# EAGLE design boomerang (EAGLE 6.4)
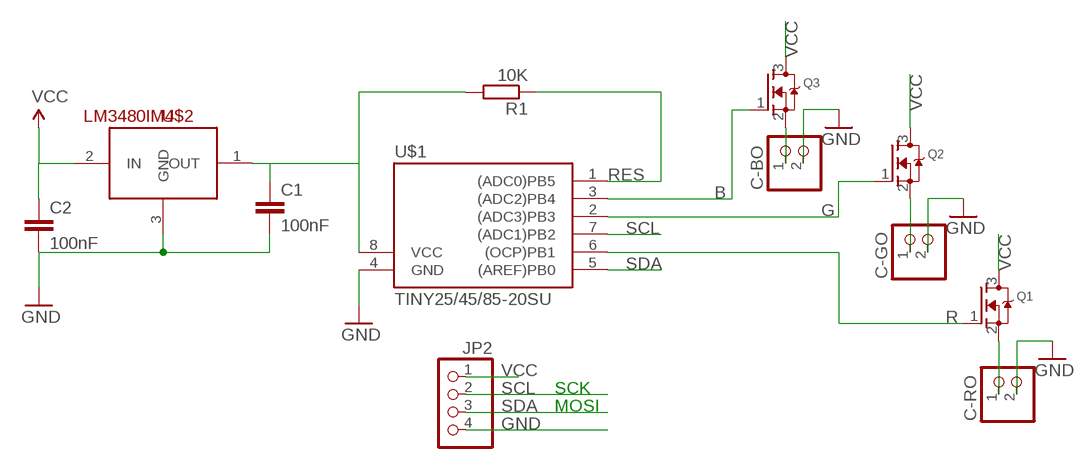
[diagram p0: schematic, sheet 1]

## Parts
C1  100nF  C-EUC0603  [C0603]
C2  100nF  C-EUC0603  [C0603]
C-BO  PINHD-1X2M  [1X02M]
C-GO  PINHD-1X2M  [1X02M]
C-RO  PINHD-1X2M  [1X02M]
JP2  PINHD-1X4_2.54-SMD-90°  [1X04SMD/90]
Q1  MOSFET-NREFLOW  [SOT23]
Q2  MOSFET-NREFLOW  [SOT23]
Q3  MOSFET-NREFLOW  [SOT23]
R1  10K  R-EU_R0603  [R0603]
U$1  TINY25/45/85-20SU  [SOIC8]
U$2  LM3480IM4  [SOT23-3]

## Nets
B: Q3.1(G) U$1.3((ADC2)PB4)
BO: C-BO.1 Q3.2(S)
G: Q2.1(G) U$1.2((ADC3)PB3)
GND: C1.2 C2.2 C-BO.2 C-GO.2 C-RO.2 JP2.4 U$1.4(GND) U$2.3(GND)
GO: C-GO.1 Q2.2(S)
R: Q1.1(G) U$1.6((OCP)PB1)
RES: R1.1 U$1.1((ADC0)PB5)
RO: C-RO.1 Q1.2(S)
SCL: JP2.2 U$1.7((ADC1)PB2)
SDA: JP2.3 U$1.5((AREF)PB0)
VCC: C2.1 JP2.1 Q1.3(D) Q2.3(D) Q3.3(D) U$2.2(IN)
VCC_GOOD: C1.1 R1.2 U$1.8(VCC) U$2.1(OUT)

## Notes on the sheet
- SCK
- MOSI

## Library data of the parts
C1 C2 = resistor:C-EU: CAPACITOR, European symbol
C-BO C-GO C-RO = pinhead:PINHD-1X2: PIN HEADER
JP2 = pinhead-1:PINHD-1X4: PIN HEADER
Q1-Q3 = adafruit:MOSFET-N: N-Channel Mosfet 2N7002E - 60V 260mA SOT23 [Digikey: 2N7002ET1GOSTR-ND] - REEL BSH103 - 30V 850mA SOT23 [Digikey: 568-5013-1-ND]
R1 = resistor:R-EU_: RESISTOR, European symbol
U$1 = avr-7:TINY25/45/85
U$2 = SparkFun-PowerIC:LM3480IM4: Small package linear regulator

## Board
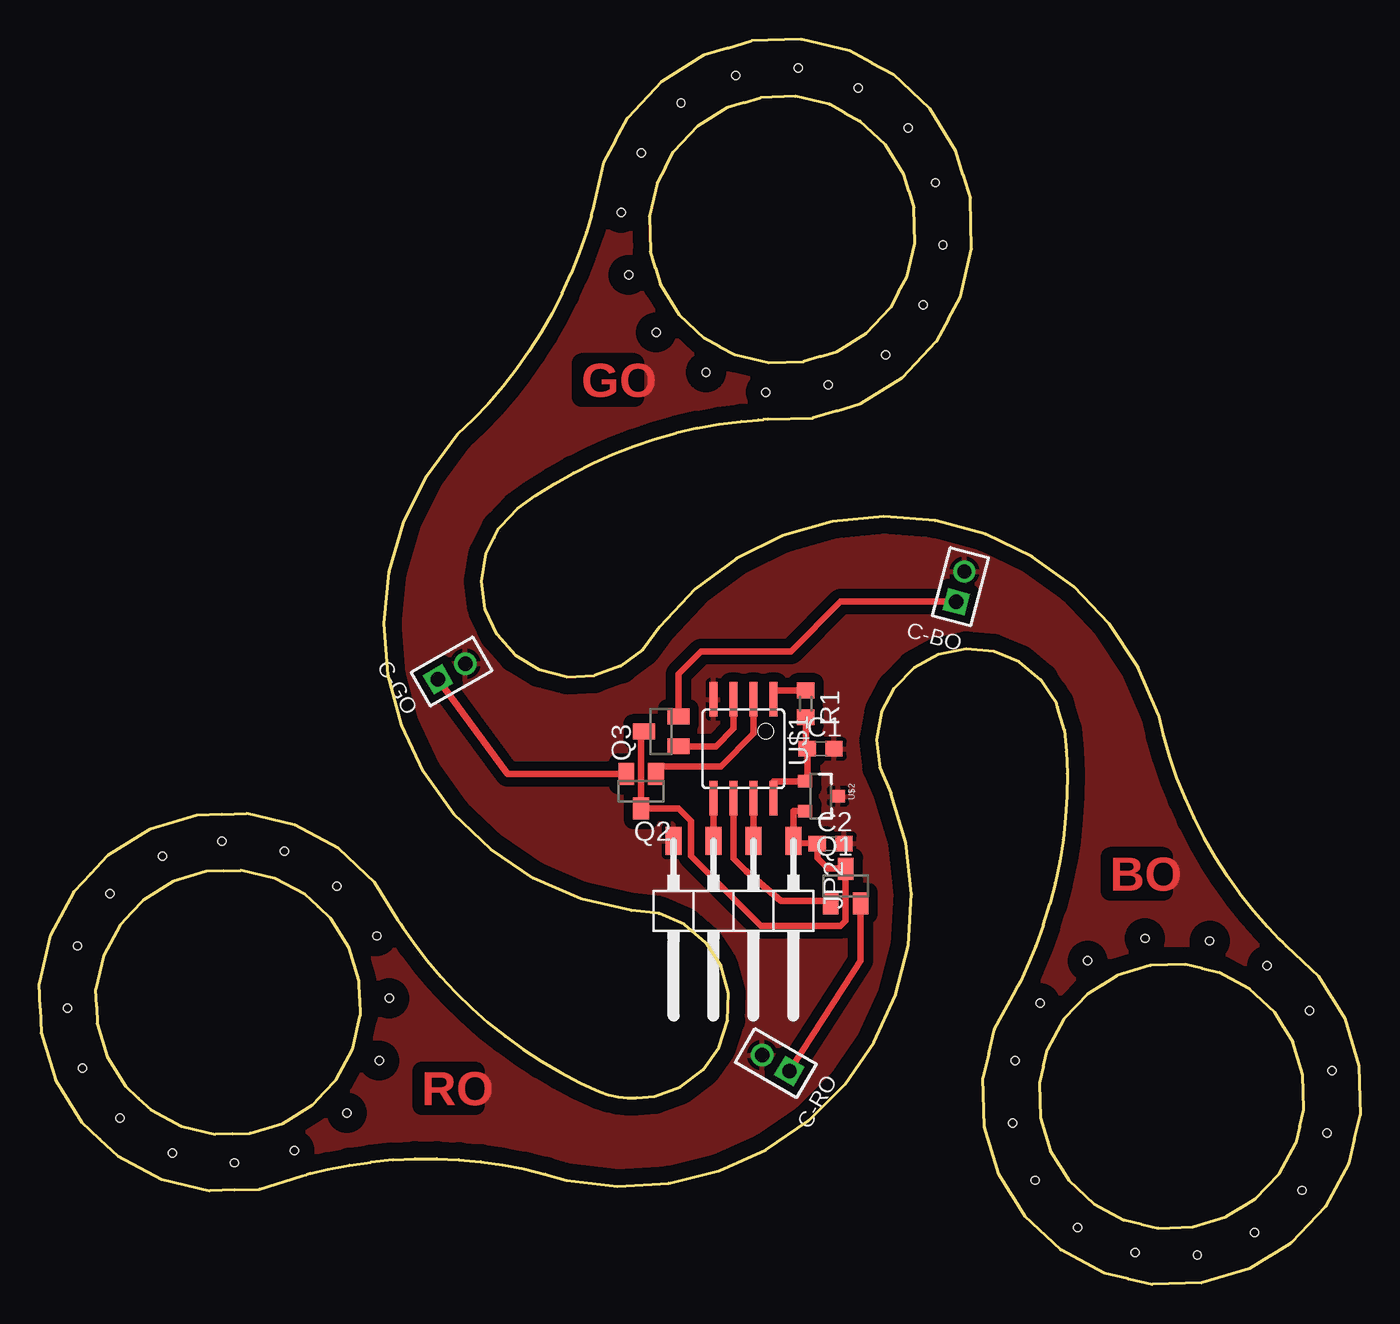
[diagram p1: board, top side]

Size 84.08 x 79.26 mm. Coordinates in mm from the lower left corner, seen from the top.
Outline: 78.93,21.97 79.15,21.76 79.36,21.54 81.44,19.61 82.27,18.27 83.09,16.93 83.99,13.92 84.08,10.78 83.71,9.25 83.35,7.72 81.85,4.95 79.68,2.66 78.34,1.83 77,1.01 73.99,0.1 70.84,0 69.31,0.36 67.78,0.72 65.01,2.2 62.72,4.35 61.89,5.68 61.07,7.02 60.16,10.03 60.07,13.17 60.43,14.7 60.79,16.23 62.16,18.73 62.29,19.01 62.43,19.27 62.89,20.27 63.43,21.56 63.91,22.87 64.32,24.21 64.67,25.57 64.96,26.94 65.17,28.32 65.32,29.71 65.41,31.11 65.42,32.51 65.37,33.91 65.25,35.31 64.82,36.77 64.74,37.01 64.39,37.53 63.76,38.49 62.39,39.62 60.75,40.29 58.98,40.46 57.24,40.1 55.68,39.25 54.44,37.98 53.62,36.4 53.3,34.65 53.5,32.89 54.21,31.26 55.16,28.12 55.53,24.86 55.31,21.59 54.5,18.41 53.14,15.43 51.27,12.74 48.94,10.43 46.24,8.57 43.25,7.23 40.07,6.44 36.8,6.24 33.55,6.62 32.21,7.02 30.85,7.35 29.48,7.61 28.09,7.81 26.7,7.94 25.3,8 23.91,8 22.51,7.93 21.12,7.79 19.74,7.59 18.37,7.32 17.3,7.07 17.01,6.98 16.72,6.91 14,6.07 12.43,6.02 10.85,5.97 7.79,6.69 5.01,8.17 3.85,9.25 2.7,10.33 1.03,13 0.11,16.01 0.06,17.58 0,19.16 0.71,22.22 2.19,25 3.26,26.15 4.34,27.3 7.02,28.96 10.03,29.87 11.61,29.92 13.19,29.97 16.26,29.25 19.05,27.76 20.2,26.68 21.35,25.6 22.84,23.17 23.02,22.92 23.18,22.66 23.81,21.77 24.66,20.66 25.57,19.59 26.52,18.57 27.52,17.59 28.57,16.66 29.66,15.79 30.8,14.97 31.97,14.2 33.17,13.49 34.41,12.84 35.68,12.26 36.25,12.06 36.83,11.94 37.16,11.91 37.43,11.88 38.03,11.89 39.17,11.96 40.83,12.58 42.23,13.67 43.26,15.11 43.82,16.79 43.86,18.56 43.38,20.26 42.43,21.76 41.07,22.9 39.45,23.61 37.68,23.8 34.49,24.55 31.47,25.85 28.74,27.68 26.38,29.96 24.47,32.64 23.07,35.61 22.21,38.78 21.95,42.06 22.27,45.34 23.18,48.5 24.64,51.45 26.6,54.09 27.62,55.06 28.59,56.08 29.51,57.15 30.37,58.25 31.18,59.4 31.94,60.59 32.64,61.81 33.28,63.06 33.85,64.35 34.37,65.66 34.82,66.99 35.14,68.05 35.21,68.35 35.29,68.64 35.93,71.44 36.68,72.84 37.43,74.24 39.59,76.56 42.29,78.24 43.81,78.7 45.32,79.16 48.49,79.26 51.58,78.53 52.97,77.78 54.37,77.03 56.68,74.85 58.34,72.15 58.8,70.63 59.25,69.1 59.35,65.93 58.62,62.84 57.87,61.44 57.12,60.04 54.95,57.73 52.26,56.06 50.74,55.6 49.23,55.14 46.37,55.07 46.07,55.04 45.76,55.03 44.67,54.93 43.28,54.75 41.89,54.5 40.53,54.19 39.17,53.81 37.84,53.36 36.53,52.85 35.25,52.28 34,51.65 32.78,50.96 31.59,50.21 30.44,49.4 29.4,48.29 29.22,48.11 28.95,47.54 28.44,46.51 28.15,44.75 28.39,42.99 29.13,41.37 30.31,40.04 31.83,39.12 33.55,38.68 35.33,38.76 37,39.36 38.43,40.42 39.48,41.85 41.73,44.25 44.37,46.21 47.32,47.67 50.49,48.57 53.76,48.89 57.04,48.61 60.21,47.76 63.18,46.34 65.85,44.42 68.12,42.05 69.93,39.31 71.22,36.29 71.54,34.92 71.93,33.58 72.39,32.25 72.91,30.95 73.49,29.68 74.13,28.44 74.83,27.23 75.58,26.05 76.4,24.92 77.26,23.82 78.18,22.77 78.93,21.97
Outline: 46.43,58.67 48.64,58.74 49.7,59.06 50.76,59.38 52.65,60.55 54.17,62.17 54.69,63.15 55.22,64.13 55.73,66.29 55.66,68.51 55.34,69.58 55.02,70.64 53.85,72.54 52.24,74.06 51.26,74.59 50.29,75.11 48.13,75.62 45.91,75.55 44.85,75.23 43.79,74.91 41.9,73.73 40.38,72.11 39.86,71.13 39.34,70.15 38.83,67.98 38.9,65.76 39.22,64.7 39.54,63.63 40.71,61.75 42.32,60.23 43.3,59.7 44.27,59.18 46.43,58.67
Outline: 65.23,16.89 64.18,14.95 63.93,13.88 63.67,12.81 63.74,10.61 64.37,8.5 64.95,7.57 65.53,6.63 67.13,5.13 69.07,4.09 70.14,3.84 71.21,3.59 73.42,3.66 75.53,4.29 76.46,4.87 77.4,5.45 78.92,7.05 79.97,8.99 80.22,10.06 80.48,11.13 80.42,13.33 79.79,15.44 79.21,16.38 78.63,17.31 77.03,18.82 75.09,19.86 74.01,20.12 72.94,20.37 70.73,20.3 68.62,19.66 67.68,19.08 66.74,18.5 65.23,16.89
Outline: 19.72,21.43 18.55,23.31 17.74,24.06 16.94,24.82 14.99,25.86 12.84,26.36 11.73,26.33 10.63,26.29 8.52,25.66 6.65,24.49 5.89,23.69 5.14,22.88 4.1,20.94 3.61,18.8 3.64,17.69 3.68,16.59 4.33,14.49 5.5,12.61 6.3,11.86 7.11,11.11 9.05,10.07 11.2,9.57 12.3,9.6 13.41,9.63 15.52,10.27 17.39,11.43 18.14,12.23 18.89,13.03 19.93,14.97 20.43,17.12 20.39,18.22 20.36,19.32 19.72,21.43
Copper layers (1*16): Top 0.035mm / dielectric 1.5mm / Bottom 0.035mm
Design rules "default": minimum track width 10mil, minimum drill 24mil, track to track 8mil, track to pad 8mil, pad to pad 8mil, via to via 8mil, smd to smd 8mil, copper to edge 40mil, drill to drill 8mil, minimum pad ring 10mil, minimum via ring 8mil, stop-mask expansion 4mil, vias tented up to drill 0mil, thermal gap 10mil
Holes 0.5 mm at 39.26,60.61 42.43,58.07 46.24,56.8 50.21,57.27 53.86,59.18 56.25,62.35 57.52,66.16 57.04,70.13 55.29,73.62 52.12,76.16 48.31,77.43 44.34,76.96 40.85,75.21 38.31,72.04 37.04,68.23 37.51,64.26 73.71,1.87 69.74,2.03 66.09,3.61 63.39,6.63 61.96,10.28 62.12,14.25 63.71,17.9 66.72,20.6 70.37,22.03 74.5,21.87 78.15,20.28 82.28,13.62 80.85,17.43 81.96,9.65 80.38,6 77.36,3.3 7.83,27.27 11.64,28.22 15.61,27.59 18.94,25.36 21.48,22.19 22.27,18.22 21.64,14.25 19.57,10.92 16.24,8.54 12.43,7.74 8.46,8.38 2.75,13.77 5.13,10.6 1.79,17.58 2.43,21.55 4.49,24.89

### Footprints (pad centres in the part's own frame; a part is rotated, then mirrored left to right if it is on the bottom)
C0603 = smd 1.1 x 1: 1 -0.85,0; 2 0.85,0
1X02M = drill 0.914 square: 1 -1,0 | drill 0.914: 2 1,0
1X04SMD/90 = smd 1.016 x 1.778: 1 -1.27,-5.08; 2 1.27,-5.08; 3 3.81,-5.08; 4 6.35,-5.08
SOT23 = smd 1 x 1.4: 1 -0.95,-1.1; 2 0.95,-1.1; 3 0,1.1
R0603 = smd 1 x 1.1: 1 -0.85,0; 2 0.85,0
SOIC8 = smd 0.5 x 2.2: 1 -1.905,-3.154; 2 -0.645,-3.154; 3 0.625,-3.154; 4 1.895,-3.154; 5 1.905,3.154; 6 0.635,3.154; 7 -0.635,3.154; 8 -1.905,3.154
SOT23-3 = smd 0.8 x 0.9: 1 -0.95,-1; 2 0.95,-1; 3 0,1.1

### Placement (x,y rotation side)
C1  49.74,34.09 0 top
C2  50.37,28.06 0 top
C-BO  58.63,44.41 75 top
C-GO  26.24,39.02 30 top
C-RO  46.88,14.09 150 top
JP2  46.72,23.14 180 top
Q1  51.32,25.36 0 top
Q2  38.31,31.4 180 top
Q3  39.58,35.21 90 top
R1  48.78,36.95 270 top
U$1  44.82,34.09 180 top
U$2  49.74,31.08 270 top

### Tracks (layer width: path | path; a pad name or v marks a point on that pad's centre or on a via)
B
  Top 0.406: Q3.1 42.12,34.26 42.12,34.25 43.07,34.25 44.19,35.37 U$1.3
BO
  Top 0.406: C-BO.1 58.36,43.46 51.01,43.46 47.83,40.29 42.12,40.29 40.68,38.85 Q3.2
G
  Top 0.406: U$1.2 45.46,35.06 43.39,32.98 39.74,32.98 Q2.1
GND
  pour Top (isolate 0.61): 8.78,87.59 118.63,87.59 95.46,-10.51 -28.69,-5.43
GO
  Top 0.406: C-GO.1 29.81,32.5 Q2.2
R
  Top 0.406: U$1.6 44.18,27.11 44.98,26.32 47.2,24.41 50.23,24.41 Q1.1
RES
  Top 0.406: R1.1 46.72,37.8 U$1.1
RO
  Top 0.406: Q1.2 52.28,20.6 C-RO.1
SCL
  Top 0.406: U$1.7 JP2.2
SDA
  Top 0.406: U$1.5 JP2.3
VCC
  Top 0.406: U$2.2 47.99,30.13 JP2.1 48.21,28.12 C2.1 49.52,27.17 50.21,26.47 51.31,26.47 Q1.3 51.32,23.14 51.01,22.82 45.93,22.82 41.48,27.27 41.48,29.49 40.68,30.3 Q2.3 38.31,35.04 Q3.3
VCC_GOOD
  Top 0.406: U$1.8 46.72,32.03 U$2.1 48.89,32.03 C1.1 48.79,34.09 R1.2

### Text on the board
Top: GO | BO | RO